# EAGLE design BHOnOfreBoard_Rev2_Charly (EAGLE 7.2.0)
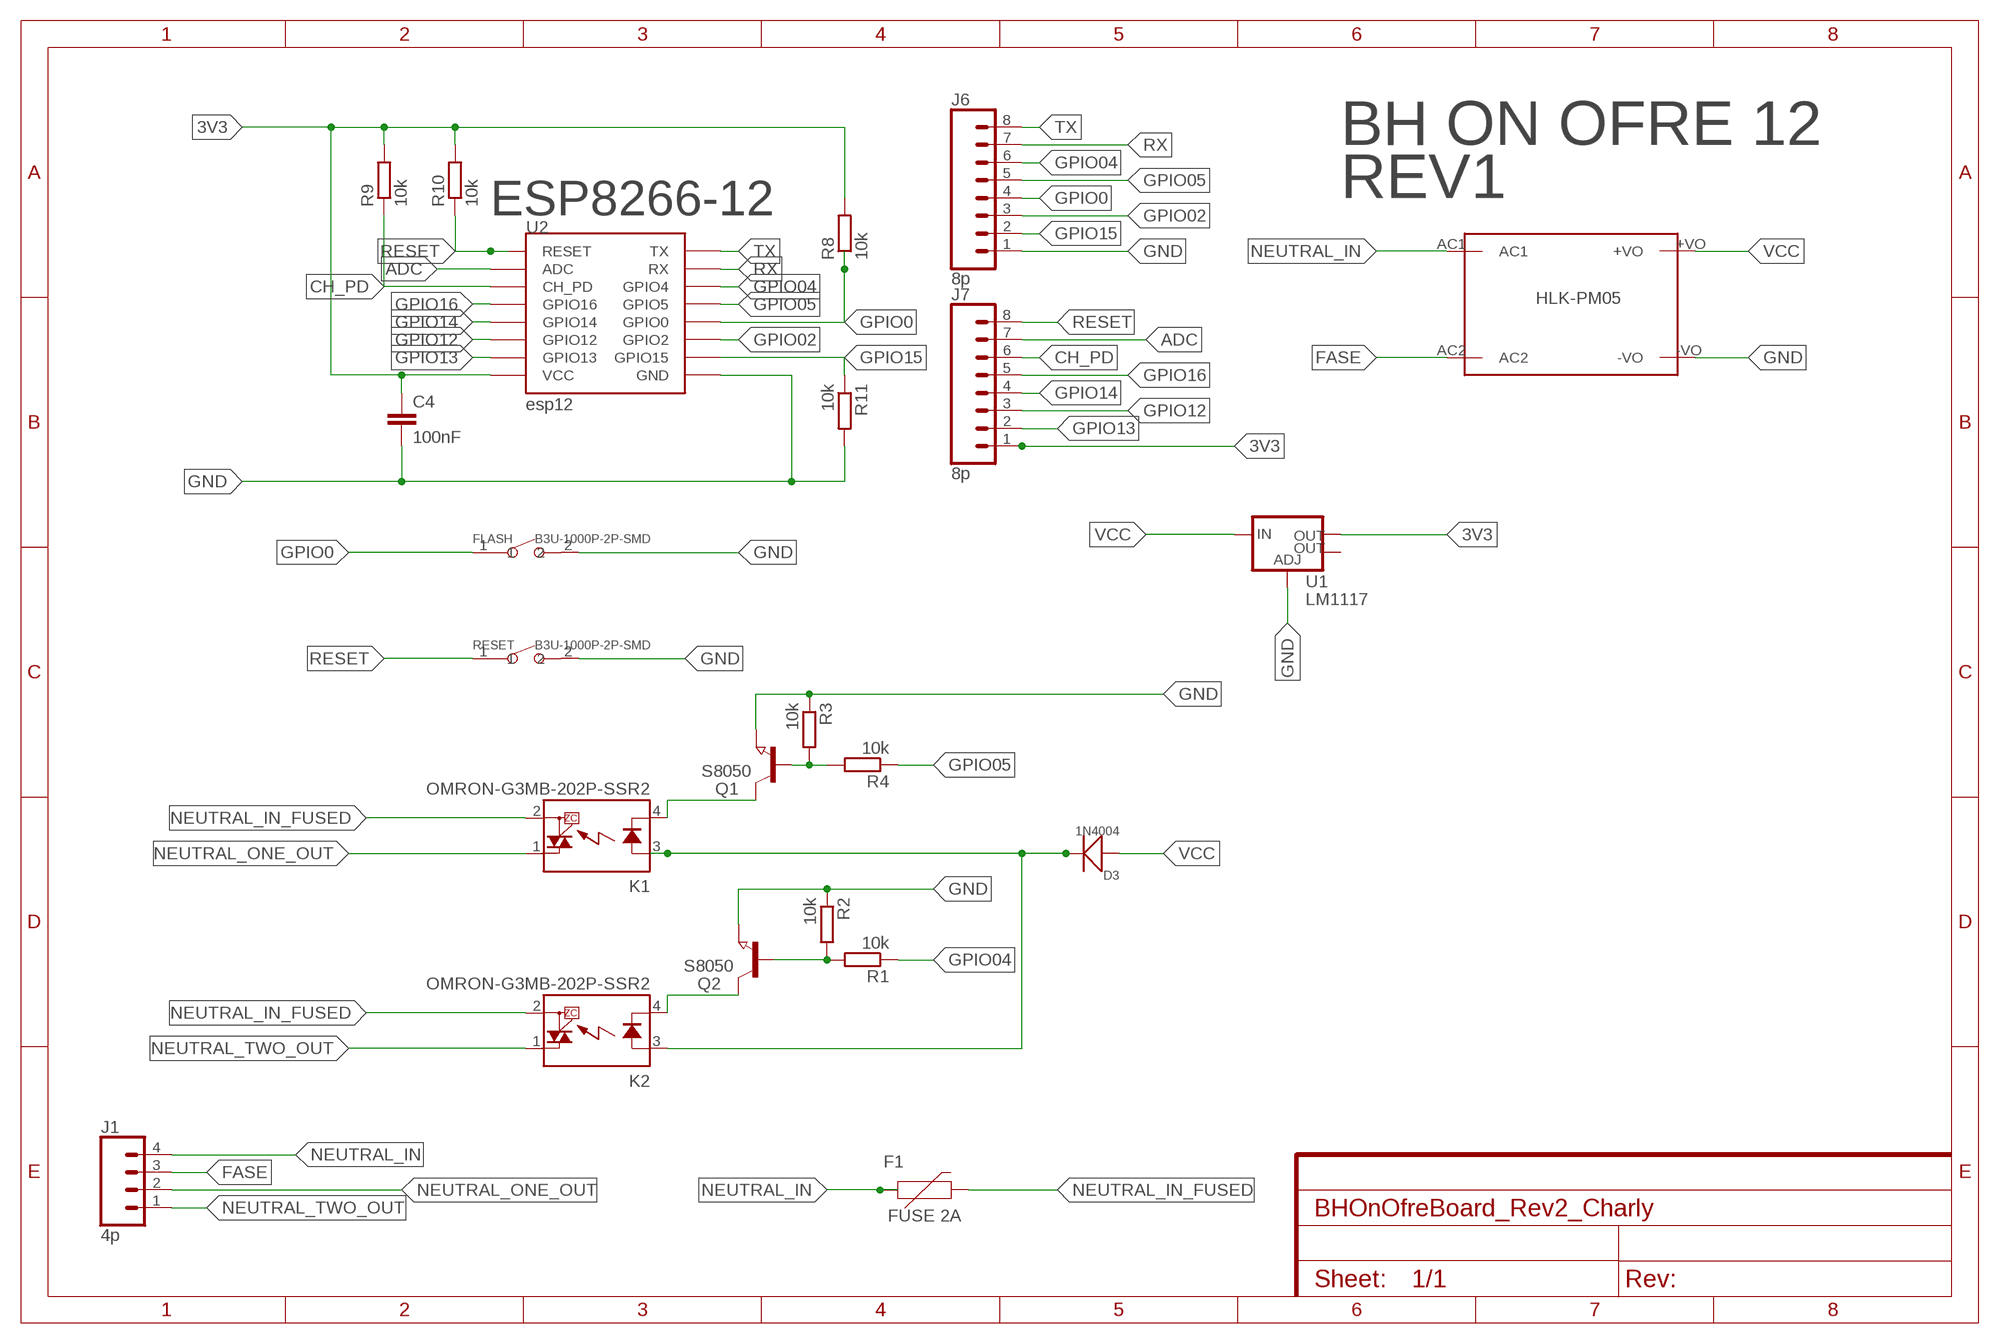
[diagram p0: schematic, sheet 1]

## Parts
C4  100nF  10NF-0603-50V-10%  [0603]
D3  1N4004  DIODE-GEN-PURPOSE-1KV-1A(DO-214AC)  [DO-214AC]
F1  FUSE 2A  PPTC_PTH  [PTH]
FLASH  B3U-1000P-2P-SMD  SMD-BUTTON(2P-3.0X2.5X1.2+0.4MM)-B3U-1000P-2P-SMD  [SW2-2.6-3.0X2.5X1.2+0.4MM]
J1  4p  CONN_04SCREW  [SCREWTERMINAL-3.5MM-4]
J6  8p  CONN_08"  [1X08]
J7  8p  CONN_08"  [1X08]
K1  OMRON-G3MB-202P-SSR2  [OMRON-G3MB-202P-SSR]
K2  OMRON-G3MB-202P-SSR2  [OMRON-G3MB-202P-SSR]
Q1  S8050  NPN-TRANSISTOR_SOT23  [SOT23]
Q2  S8050  NPN-TRANSISTOR_SOT23  [SOT23]
R1  10k  R-EU_R0603  [R0603]
R2  10k  R-EU_R0603  [R0603]
R3  10k  R-EU_R0603  [R0603]
R4  10k  R-EU_R0603  [R0603]
R8  10k  R-EU_R0603  [R0603]
R9  10k  R-EU_R0603  [R0603]
R10  10k  R-EU_R0603  [R0603]
R11  10k  R-EU_R0603  [R0603]
RESET  B3U-1000P-2P-SMD  SMD-BUTTON(2P-3.0X2.5X1.2+0.4MM)-B3U-1000P-2P-SMD  [SW2-2.6-3.0X2.5X1.2+0.4MM]
U1  LM1117  V_REG_LM1117SOT223  [SOT223]
U2  esp12  ESP12SMD  [ESP12-SMD]
U$2  HLK-PM03  [HLK-PM03]

## Nets
3V3: C4.1 J7.1 R8.2 R9.2 R10.2 U1.2(OUT) U2.VCC
ADC: J7.7 U2.ADC
CH_PD: J7.6 R9.1 U2.CH_PD
FASE: J1.3 U$2.AC2
GND: C4.2 FLASH.2 J6.1 Q1.2(E) Q2.2(E) R2.1 R3.1 R11.2 RESET.2 U1.1(ADJ) U2.GND U$2.-VO
GPIO0: FLASH.1 J6.4 R8.1 U2.GPIO0
GPIO02: J6.3 U2.GPIO2
GPIO04: J6.6 R1.1 U2.GPIO4
GPIO05: J6.5 R4.1 U2.GPIO5
GPIO12: J7.3 U2.GPIO12
GPIO13: J7.2 U2.GPIO13
GPIO14: J7.4 U2.GPIO14
GPIO15: J6.2 R11.1 U2.GPIO15
GPIO16: J7.5 U2.GPIO16
N$1: K1.4(K) Q1.3(C)
N$2: D3.2(-) K1.3(A) K2.3(A)
N$7: Q1.1(B) R3.2 R4.2
N$9: K2.4(K) Q2.3(C)
N$13: Q2.1(B) R1.2 R2.2
NEUTRAL_IN: F1.P$1 J1.4 U$2.AC1
NEUTRAL_IN_FUSED: F1.P$2 K1.2(DS2) K2.2(DS2)
NEUTRAL_ONE_OUT: J1.2 K1.1(DS1)
NEUTRAL_TWO_OUT: J1.1 K2.1(DS1)
RESET: J7.8 R10.1 RESET.1 U2.RESET
RX: J6.7 U2.RXD0(RX)
TX: J6.8 U2.TXD0(TX)
VCC: D3.1(+) U1.3(IN) U$2.+VO
Unconnected: U1.4(OUT)

## Notes on the sheet
- BH ON OFRE 12
- REV1
- ESP8266-12
- HLK-PM05

## Library data of the parts
C4 = SparkFun-Capacitors:10NF: 0.01uF/10nF/10,000pF ceramic capacitors A capacitor is a passive two-terminal electrical component used to store electrical energy temporarily in an electric field. CAP-09321; PROD_ID: CAP-00867; VALUE: 10nF
D3 = Seeed-Diode:DIODE-GEN-PURPOSE-1KV-1A(DO-214AC): 304010013; MPN: 1N4007; VALUE: 1N4007
F1 = SparkFun-Fuses:PPTC: Resettable Fuse PPTC Resettable Fuse. Really a sort of resistor with a polymeric positive temperature coefficient whose resistance increases dramatically with an increase in temperature. When heated by the power passing through the resistance rises causing the current to be limited, protecting the circuit. This is achieved by the transition of the polymer from a crystalline to an amorphous state where the conductive carbon separates breaking the conductive pathways found in the cool crystalline structure. When a PPTC cools back down it resumes conducting letting the circuit turn back on. SparkFun Products: SparkFun RedBoard - Programmed with Arduino <https://www.sparkfun.com/products/12757> Pro Micro - 5V/16MHz <https://www.sparkfun.com/products/12640> Arduino Pro 328 - 5V/16MHz <https://www.sparkfun.com/products/10915> MP3 Trigger <https://www.sparkfun.com/products/13720>; PROD_ID: RES-08490; VALUE: 72V/0.25A
FLASH RESET = Seeed-Switch:SMD-BUTTON(2P-3.0X2.5X1.2+0.4MM): 311020047; MPN: B3U-1000P-2P-SMD
J1 = SparkFun-Connectors:CONN_04: Multi connection point. Often used as Generic Header-pin footprint for 0.1 inch spaced/style header connections On any of the 0.1 inch spaced packages, you can populate with these: Break Away Headers - Straight <https://www.sparkfun.com/products/116> (PRT-00116) Break Away Male Headers - Right Angle <https://www.sparkfun.com/products/553> (PRT-00553) Female Headers <https://www.sparkfun.com/products/115> (PRT-00115) Break Away Headers - Machine Pin <https://www.sparkfun.com/products/117> (PRT-00117) Break Away Female Headers - Swiss Machine Pin <https://www.sparkfun.com/products/743> (PRT-00743) For SCREWTERMINALS and SPRING TERMINALS visit here: Screw Terimnals on SparkFun.com <https://www.sparkfun.com/search/results?term=Screw+Terminals> (5mm/3.5mm/2.54mm spacing) This device is also useful as a general connection point to wire up your design to another part of your project. Our various solder wires solder well into these plated through hole pads. Hook-Up Wire - Assortment (Stranded, 22 AWG) <https://www.sparkfun.com/products/11375> (PRT-11375) Hook-Up Wire - Assortment (Solid Core, 22 AWG) <https://www.sparkfun.com/products/11367> (PRT-11367) View the entire wire category on our website here <https://www.sparkfun.com/categories/141> Special notes: Molex polarized connector foot print use with SKU : PRT-08231 with associated crimp pins and housings. 1MM SMD Version SKU: PRT-10208; PROD_ID: 2xCONN-08399; SF_ID: 2xPRT-08084
J6 J7 = SparkFun-Connectors:CONN_08: Multi connection point. Often used as Generic Header-pin footprint for 0.1 inch spaced/style header connections On any of the 0.1 inch spaced packages, you can populate with these: Break Away Headers - Straight <https://www.sparkfun.com/products/116> (PRT-00116) Break Away Male Headers - Right Angle <https://www.sparkfun.com/products/553> (PRT-00553) Female Headers <https://www.sparkfun.com/products/115> (PRT-00115) Break Away Headers - Machine Pin <https://www.sparkfun.com/products/117> (PRT-00117) Break Away Female Headers - Swiss Machine Pin <https://www.sparkfun.com/products/743> (PRT-00743) Arduino Stackable Header - 8 Pin <https://www.sparkfun.com/products/9279> (PRT-09279) For SCREWTERMINALS and SPRING TERMINALS visit here: Screw Terimnals on SparkFun.com <https://www.sparkfun.com/search/results?term=Screw+Terminals> (5mm/3.5mm/2.54mm spacing) This device is also useful as a general connection point to wire up your design to another part of your project. Our various solder wires solder well into these plated through hole pads. Hook-Up Wire - Assortment (Stranded, 22 AWG) <https://www.sparkfun.com/products/11375> (PRT-11375) Hook-Up Wire - Assortment (Solid Core, 22 AWG) <https://www.sparkfun.com/products/11367> (PRT-11367) View the entire wire category on our website here <https://www.sparkfun.com/categories/141> Special notes: Molex polarized connector foot print use with SKU : PRT-08231 with associated crimp pins and housings. 1MM SMD Version SKU: PRT-10208 NOTES ON THE VARIANTS LOCK and LOCK_LONGPADS... This footprint was designed to help hold the alignment of a through-hole component (i.e. 6-pin header) while soldering it into place. You may notice that each hole has been shifted either up or down by 0.005 of an inch from it's more standard position (which is a perfectly straight line). This slight alteration caused the pins (the squares in the middle) to touch the edges of the holes. Because they are alternating, it causes a "brace" to hold the component in place. 0.005 has proven to be the perfect amount of "off-center" position when using our standard breakaway headers. Although looks a little odd when you look at the bare footprint, once you have a header in there, the alteration is very hard to notice. Also,if you push a header all the way into place, it is covered up entirely on the bottom side.; PROD_ID: CONN-08438
K1 K2 = Omron G3MB 202p SSR:OMRON-G3MB-202P-SSR: IT(rms) 8A, Zero Cross type SIP 4pin Triac output SSR Source: http://sharp-world.com/products/device/lineup/data/pdf/datasheet/s102s02_e.pdf; MPN: S202S02F; OC_FARNELL: 1618475; OC_NEWARK: 14N9588
Q1 Q2 = semicon-smd-ipc:NPN-TRANSISTOR_: NPN TRANSISTOR
R1-R4 R8-R11 = resistor:R-EU_: RESISTOR, European symbol
U1 = SparkFun-IC-Power:V_REG_LM1117: Voltage Regulator LM1117 Standard adjustable voltage regulator but in SMD form. Spark Fun Electronics SKU : COM-00595; PROD_ID: VREG-08170
U2 = esp8266modules:ESP12: ESP8266 Wifi module 12
U$2 = PowerSocket:HLK-PM03

## Net classes
1 220V: clearance 2.54 mm

## Board
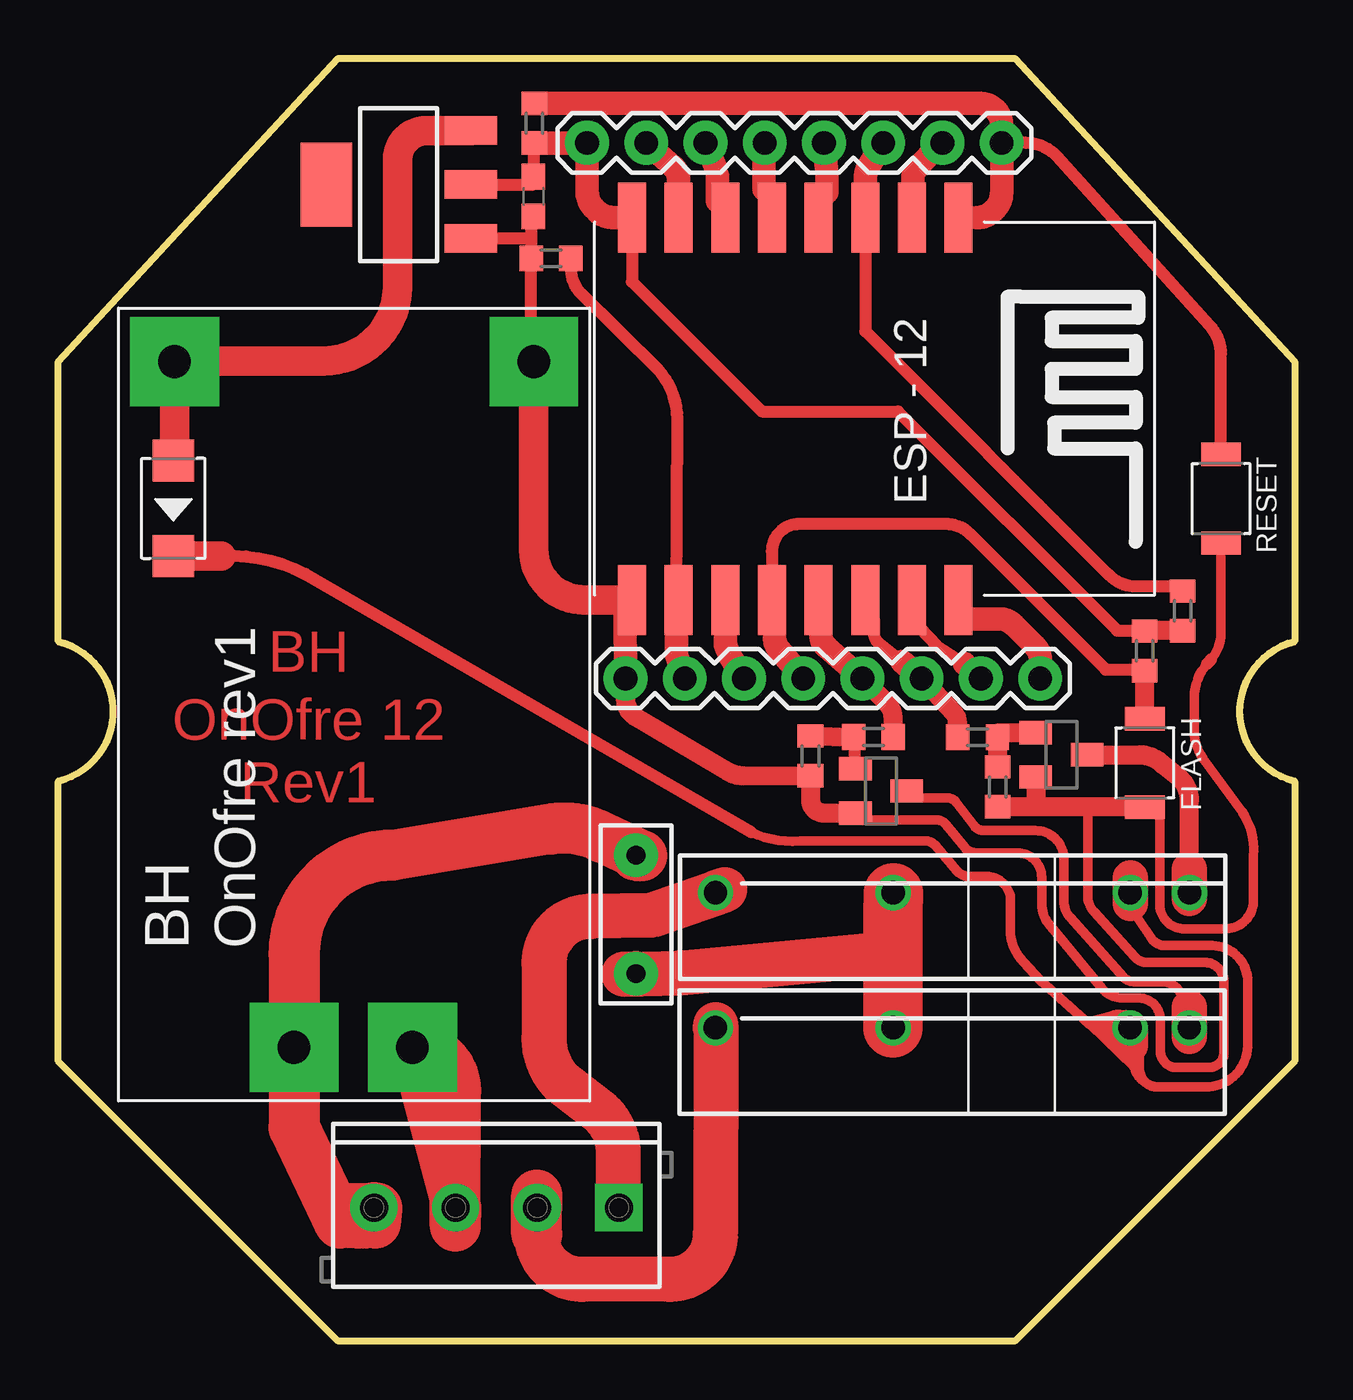
[diagram p1: board, top side]

Size 53 x 55 mm. Coordinates in mm from the lower left corner, seen from the top.
Outline: 53,12 41,0 12,0 0,12 0,24 arc152 0,30 0,42 12,55 41,55 53,42 53,30 arc152 53,24 53,12
Copper layers (1*16): Top 0.035mm / dielectric 1.5mm / Bottom 0.035mm
Design rules "default": minimum track width 6mil, minimum drill 0.35mm, track to track 6mil, track to pad 6mil, pad to pad 6mil, via to via 6mil, smd to smd 6mil, copper to edge 40mil, drill to drill 6mil, minimum pad ring 10mil, minimum via ring 8mil, stop-mask expansion 4mil, vias tented up to drill 0mil, thermal gap 10mil

### Footprints (pad centres in the part's own frame; a part is rotated, then mirrored left to right if it is on the bottom)
0603 = smd 1.1 x 1: 1 -0.85,0; 2 0.85,0
DO-214AC = smd 1.8 x 1.77: 1 -2.042,0; 2 2.042,0
PTH = drill 0.8 pad 1.88: P$1 -2.54,0; P$2 2.54,0
SW2-2.6-3.0X2.5X1.2+0.4MM = smd 1 x 1.7: 1 -1.9,0; 2 1.9,0
SCREWTERMINAL-3.5MM-4 = drill 1.2 pad 2.032 square: 1 0,0 | drill 1.2 pad 2.032: 2 3.5,0; 3 7,0; 4 10.5,0
1X08 = drill 1.016 pad 1.88: 1 0,0; 2 2.54,0; 3 5.08,0; 4 7.62,0; 5 10.16,0; 6 12.7,0; 7 15.24,0; 8 17.78,0
OMRON-G3MB-202P-SSR = drill 1: 1 -12.7,0; 2 -5.08,0; 3 5.08,0; 4 7.62,0
SOT23 = smd 1 x 1.4: 1 -0.95,-1.1; 2 0.95,-1.1; 3 0,1.1
R0603 = smd 1 x 1.1: 1 -0.85,0; 2 0.85,0
SOT223 = smd 1.219 x 2.235: 1 -2.311,-3.099; 2 0,-3.099; 3 2.311,-3.099 | smd 3.6 x 2.2: 4 0,3.099
ESP12-SMD = smd 3 x 1.2: ADC -8.3,3.8; CH_PD -8.3,1.8; GND 8.1,-8.2; GPIO0 8.1,-2.2; GPIO2 8.1,-4.2; GPIO4 8.1,1.8; GPIO5 8.1,-0.2; GPIO12 -8.3,-4.2; GPIO13 -8.3,-6.2; GPIO14 -8.3,-2.2; GPIO15 8.1,-6.2; GPIO16 -8.3,-0.2; RESET -8.3,5.8; RXD0 8.1,3.8; TXD0 8.1,5.8; VCC -8.3,-8.2
HLK-PM03 = drill 1.4 pad 3.81 square: +VO 29.4,10.2; -VO 29.4,-5.2; AC1 0,5.08; AC2 0,0

### Placement (x,y rotation side)
C4  20.37,49.07 270 top
D3  4.93,35.7 270 top
F1  24.77,18.3 270 top
FLASH  46.58,24.79 270 top
J1  24.03,5.72 180 top
J6  24.32,28.41 0 top
J7  22.66,51.37 0 top
K1  40.87,13.44 0 top
K2  40.88,19.23 0 top
Q1  35.27,23.59 270 top
Q2  43.01,25.14 270 top
R1  39.41,25.9 0 top
R2  40.27,23.77 90 top
R3  32.25,25.09 90 top
R4  34.95,25.91 180 top
R8  46.57,29.6 90 top
R9  48.2,31.31 270 top
R10  20.4,52.22 270 top
R11  21.12,46.43 180 top
RESET  49.85,36.11 270 top
U1  14.59,49.59 90 top
U2  32.8,39.88 270 top
U$2  15.18,12.6 90 top

### Tracks (layer width: path | path; a pad name or v marks a point on that pad's centre or on a via)
3V3
  Top 0.508: R10.2 20.4,49.92 C4.1 20.37,49.59 U1.2 | U2.VCC 24.6,45.42 30.16,39.86 36,39.86 45.4,30.46 46.51,30.46 R8.2 46.54,30.46 | J7.1
  Top 0.813: R9.2 46.54,30.46
  Top 1.016: R10.2 J7.1 | U2.VCC 23.76,48.18 arc-45 23.09,48.46 22.96,48.58 arc-45 22.67,49.3 J7.1
ADC
  Top 0.508: J7.7 37.65,51.16
  Top 1.016: 37.65,51.16 36.86,50.38 arc44 36.63,49.82 U2.ADC
CH_PD
  Top 0.508: 34.65,48.43 U2.CH_PD 34.6,43.3 45.04,32.85 arc45 46.21,32.37 48.26,32.37 R9.1
  Top 1.016: J7.6 34.74,50.36 arc32 34.6,49.89 U2.CH_PD
FASE
  Top 2.184: J1.3 17.01,4.93 17.03,10.75 arc90 U$2.AC2
GND
  Top 0.406: RESET.2 49.85,30.34 arc-42 49.42,29.23 | 49.25,29.05 arc42 48.7,27.6 48.7,26.17 arc36 49.09,24.97 50.75,22.68 arc-36 51.24,21.15 51.24,20.72 51.24,18.83 arc-90 49.97,17.69 48.19,17.69 arc-90 47.23,18.78 47.23,23.08 46.98,22.92 | 44.13,22.92 44.13,19.14 arc42 44.41,18.4 46.12,16.49 arc48 46.69,16.24 49.21,16.24 arc-90 49.97,15.35 49.97,12.36 arc-90 49.34,11.73 47.94,11.73 arc-90 47.24,12.49 47.24,13.82 arc90 46.29,14.71 45.6,14.71 arc-51 44.75,15.11 42.45,17.91 arc-39 42.16,18.73 42.16,19.9 arc90 41.13,20.94 39.35,20.94 arc-51 38.86,21.17 38.05,22.16 arc51 37.65,22.35 34.38,22.35 Q1.2
  Top 0.508: 20.27,46.39 R11.2 | C4.2 20.27,48.22 20.27,47.28 | 20.27,47.28 R11.2 | U$2.-VO 20.27,42 R11.2 | U1.1 20.27,47.28 | 46.98,22.92 FLASH.2 arc90 46.45,22.92 | 49.42,29.23 49.25,29.05
  Top 0.61: 24.3,31.34 U2.GND
  Top 0.813: 24.44,31.77 U2.GND | J6.1 24.32,27.52 arc59 24.73,26.79 28.71,24.42 arc31 29.37,24.24 R3.1 32.25,23.22 arc90 32.83,22.64 Q1.2 | R2.1 41.92,22.92 | 41.92,22.92 44.13,22.92 46.45,22.92 | Q2.2 41.92,22.92
  Top 1.016: J6.1 24.3,31.34
  Top 1.27: U$2.-VO 20.38,33.93 arc90 22.54,31.78 24.44,31.77
GPIO0
  Top 0.508: 30.7,31.78 U2.GPIO0 30.6,33.87 arc-90 31.76,35.03 38.05,35.03 arc-45 39.1,34.6 44.91,28.79 46.47,28.79 R8.1 arc-90 R8.1
  Top 0.813: FLASH.1 R8.1
  Top 1.016: 30.7,31.78 30.7,30.91 30.7,30.17 arc39 30.9,29.66 J6.4
GPIO02
  Top 1.016: U2.GPIO2 28.6,30.12 arc31 28.8,29.38 J6.3
GPIO04
  Top 0.508: U2.GPIO4 34.96,30.97 34.96,30.39 arc54 35.21,29.9 36.17,29.14
  Top 0.813: J6.6 38.37,26.96 arc-42 38.55,26.53 R1.1
  Top 1.016: 36.17,29.14 J6.6
GPIO05
  Top 0.813: J6.5 35.52,27.36 arc-42 35.79,26.73 R4.1
  Top 1.016: U2.GPIO5 32.67,31.17 32.7,30.19 arc45 32.94,29.75 J6.5
GPIO12
  Top 0.508: 28.18,50.33 arc-23 28.25,49.97 | 28.25,48.88 28.6,48.53 U2.GPIO12
  Top 1.016: J7.3 28.18,50.33 | 28.25,49.97 28.25,48.88
GPIO13
  Top 1.016: U2.GPIO13 26.6,49.8 arc49 26.34,50.38 J7.2
GPIO14
  Top 0.508: 30.26,49.38 U2.GPIO14
  Top 1.016: J7.4 30.26,50.96 30.26,49.38
GPIO15
  Top 0.508: R11.1 21.98,45.93 arc42 22.38,44.94 25.73,41.62 arc-43 26.54,39.56 26.5,31.63 26.6,31.72 U2.GPIO15
  Top 1.016: J6.2 26.5,29.41 26.5,31.63
GPIO16
  Top 0.508: 32.95,50.06 arc-5 32.95,49.98 | 32.95,49.26 32.7,48.88 U2.GPIO16
  Top 1.016: J7.5 32.95,50.06 | 32.95,49.98 32.95,49.26
N$1
  Top 0.406: 48.41,14.56 47.93,15.18 arc39 47.26,15.41 46.13,15.41 arc-48 45.65,15.62 43.38,18.16 arc-42 43.11,18.86 43.11,20.68 arc90 41.9,21.89 39.68,21.89 arc-52 39.28,22.09 38.48,23.11 arc52 38.13,23.29 36.64,23.29 Q1.3
  Top 0.508: 48.41,14.56 48.48,14.31
  Top 1.422: K1.4 48.5,13.43
  Top 1.524: 48.5,13.43 48.5,13.06 48.48,14.31
N$2
  Top 0.406: 45.96,18.76 arc43 45.85,18.77 46.83,17.3 arc47 47.38,16.96 49.34,16.96 arc-90 50.99,15.54 50.99,12.81 arc-90 49.34,10.9 47.3,10.9 arc-90 46.1,11.92 45.97,12.68 | 29.7,21.83 arc31 31.79,21.44 37.18,21.44 arc-50 37.59,21.25 38.52,20.17 arc50 39.05,19.92 39.8,19.92 arc-90 40.83,18.9 40.83,17.46 arc39 41.37,16.26 42.1,15.48 44.18,13.61 arc51 45.43,13.44
  Top 0.508: 6.99,33.66 arc-31 10.59,32.9 29.7,21.83
  Top 1.27: D3.2 6.99,33.66
  Top 1.422: K2.3 45.97,19.86
  Top 1.524: 45.97,19.86 45.96,18.76 | 45.97,12.68 45.97,13.12 K1.3 45.44,13.44 45.43,13.44
N$3
  Top 1.93: 15.17,12.55 17.01,5.63
N$4
  Top 0.406: 44.26,13.57 46.1,11.79
N$5
  Top 0.406: 45.25,13.96 44.19,13.7
N$6
  Top 0.406: 46.35,12.3 46.35,11.67 arc85 47.05,10.9
N$7
  Top 0.508: R4.2 Q1.1
  Top 0.813: R3.2 R4.2
N$9
  Top 0.813: Q2.3 46.39,25.14 arc-47 47.34,24.72 48.02,24.18 arc-51 48.5,23.18 48.5,20.23
  Top 1.422: 48.5,18.97 arc-90 K2.4
  Top 1.524: 48.5,20.23 48.5,18.97
N$13
  Top 0.508: R1.2 R2.2
  Top 0.813: R2.2 40.32,26.09 Q2.1
NEUTRAL_IN
  Top 2.184: J1.4 13.59,5.06 13.65,5.7 13.14,5.06 12.06,5.13 13.59,5.7 11.81,5.7 12.06,5.06 10.1,9.15 U$2.AC1 10.1,16.62 arc-90 14.32,20.84 21.11,21.95 arc-37 23.33,21.59 25.01,20.81 F1.P$1
NEUTRAL_IN_FUSED
  Top 1.93: F1.P$2 24.25,15.73 26.67,15.79 35.79,16.64
  Top 2.54: K2.2 35.79,18.34 35.79,16.64 K1.2
NEUTRAL_ONE_OUT
  Top 1.778: 20.51,5.72 J1.2
  Top 1.93: K1.1 28.19,13.57 28.17,4.6 arc-90 26.22,2.65 22.45,2.65 arc-90 20.51,4.59
  Top 2.184: 20.51,4.59 20.51,6.27 20.51,5.72
NEUTRAL_TWO_OUT
  Top 1.93: J1.1 24,5.76 24,8.17 arc45 23.3,9.76 21.61,11.07 arc-45 20.82,12.97 20.82,16.23 arc-90 22.8,18.21 25.4,18.26 28.57,19.35 K2.1
RESET
  Top 0.508: RESET.1 49.85,42.33 arc43 49.36,43.55 42.82,50.8 arc47 41.48,51.37 J7.8 | 39.37,48.17 38.61,48.17 U2.RESET
  Top 1.016: R10.1 39.52,53.07 arc-90 40.44,52.14 J7.8 40.44,49.27 arc-45 40.13,48.51 40.08,48.46 arc-45 39.37,48.17
RX
  Top 0.508: 36.6,31.37 U2.RXD0 36.6,30.93 37.64,29.82 38.85,29.06
  Top 1.016: 38.85,29.06 J6.7
TX
  Top 0.508: U2.TXD0 38.67,30.97 | J6.8
  Top 1.016: 38.67,30.97 40.34,30.97 arc-45 40.97,30.7 41.87,29.8 arc-45 42.1,29.25 J6.8
VCC
  Top 0.508: 4.98,42.02 U$2.+VO
  Top 0.61: 4.98,37.8 D3.1
  Top 1.27: 4.98,37.8 U$2.+VO | U1.3 15.78,51.9 arc90 14.54,50.65 14.54,45.19 arc-90 11.36,42.02 4.98,42.02

### Text on the board
Top: BH | OnOfre 12 / Rev1
tNames: BH | OnOfre rev1